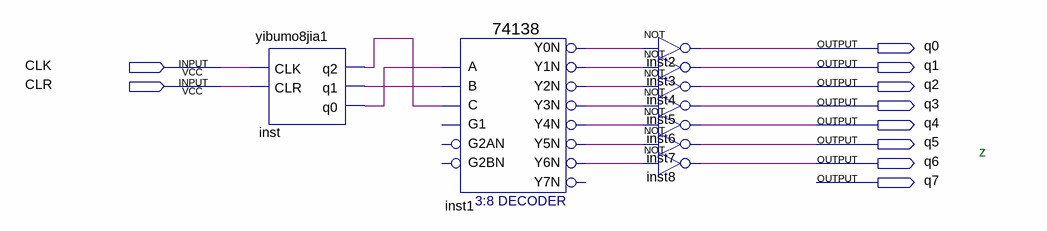
[diagram p0: schematic sheet]
// Quartus schematic jiepai.bdf as structural Verilog: 9 symbols, 10 pins
module jiepai (
  input  CLK,
  input  CLR,
  output q0,
  output q1,
  output q2,
  output q3,
  output q4,
  output q5,
  output q6,
  output q7
);

  wire inst1_y0n, inst1_y1n, inst1_y2n, inst1_y3n, inst1_y4n, inst1_y5n, inst1_y6n, inst_q0, inst_q1, inst_q2;

  yibumo8jia1 inst (.CLK(CLK), .CLR(CLR), .q2(inst_q2), .q1(inst_q1), .q0(inst_q0));
  \74138  inst1 (
    .A(inst_q0), .B(inst_q1), .C(inst_q2), .Y0N(inst1_y0n), .Y1N(inst1_y1n), .Y2N(inst1_y2n),
    .Y3N(inst1_y3n), .Y4N(inst1_y4n), .Y5N(inst1_y5n), .Y6N(inst1_y6n));  // open: G1, G2AN, G2BN, Y7N
  not inst2 (q0, inst1_y0n);
  not inst3 (q1, inst1_y1n);
  not inst4 (q2, inst1_y2n);
  not inst5 (q3, inst1_y3n);
  not inst6 (q4, inst1_y4n);
  not inst7 (q5, inst1_y5n);
  not inst8 (q6, inst1_y6n);

  // Notes on the sheet:
  //   z
endmodule
